# EAGLE schematic EsquematicoPractica1 (EAGLE 8.6.0)

## Sheet 1 of 2
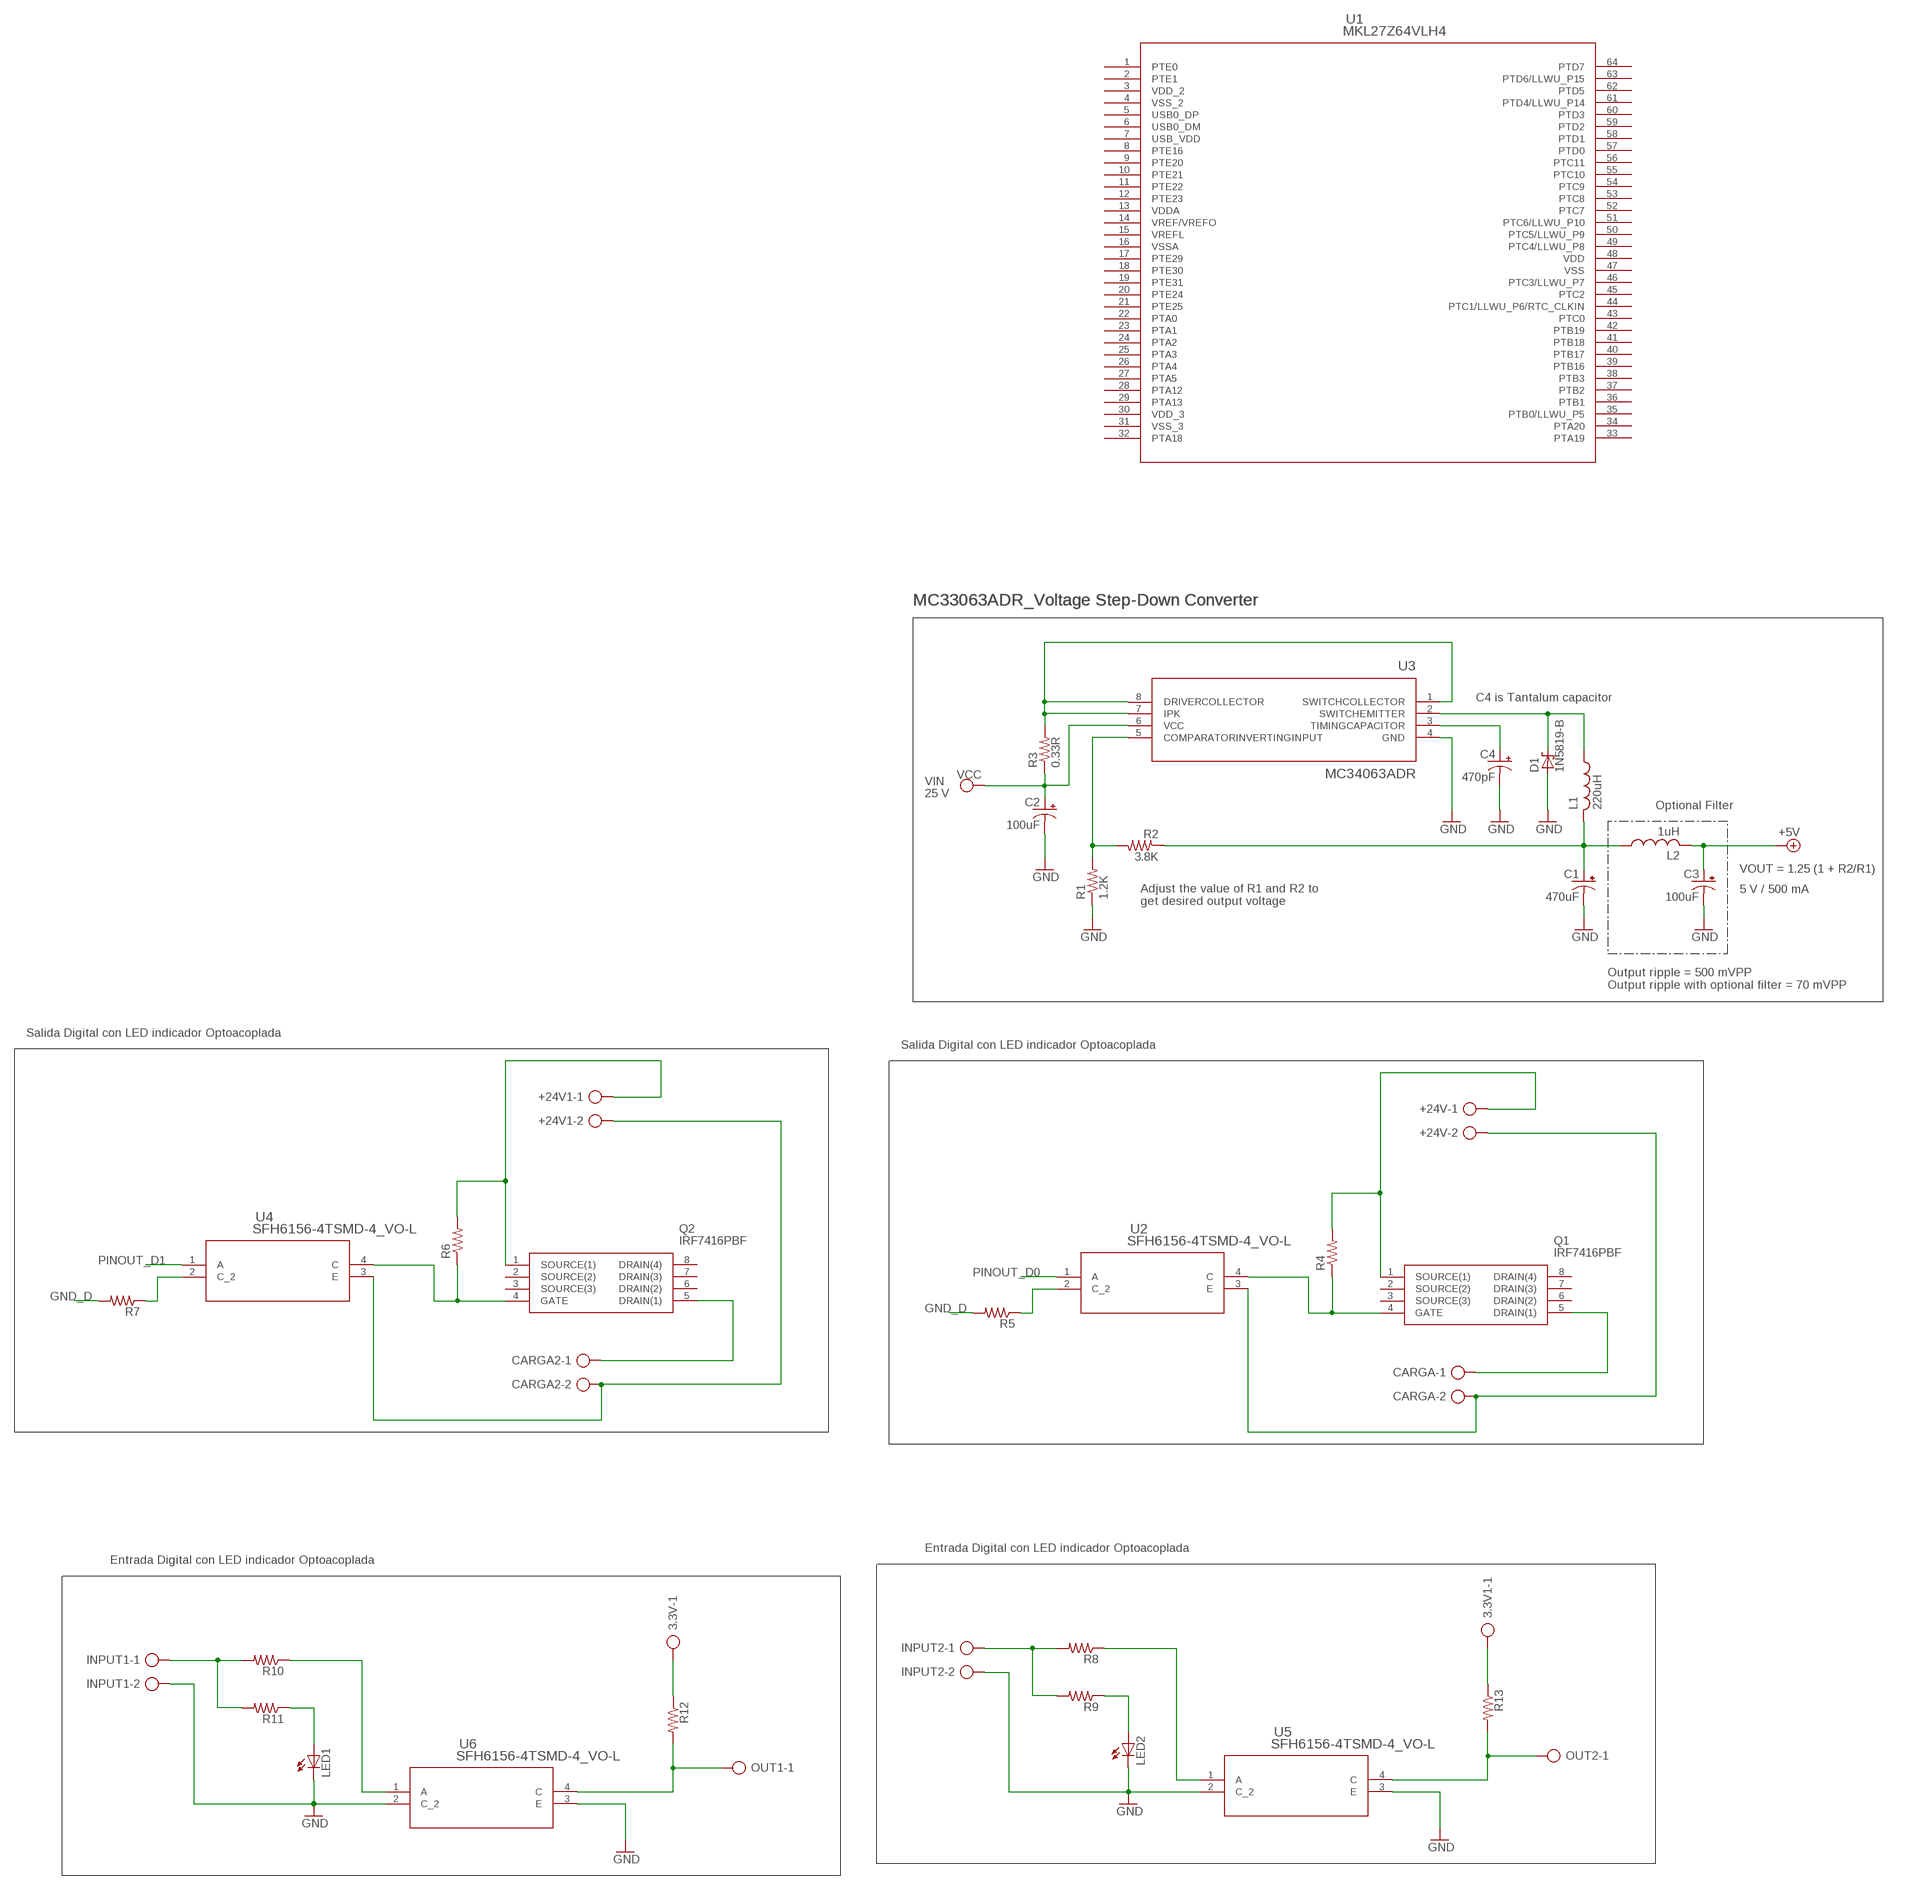
[diagram p0: schematic, sheet 1]

### Parts
3.3V  AK300/2  [AK300/2]
3.3V1  AK300/2  [AK300/2]
+24V  AK300/2  [AK300/2]
+24V1  AK300/2  [AK300/2]
C1  470uF  CPOL-USE7.5-16  [E7,5-16]
C2  100uF  CPOL-USE2,5-6E  [E2,5-6E]
C3  100uF  CPOL-USE2,5-6E  [E2,5-6E]
C4  470pF  CPOL-USE2,5-6E  [E2,5-6E]
CARGA  AK300/2  [AK300/2]
CARGA2  AK300/2  [AK300/2]
D1  1N5819-B  [DO41-7.6]
INPUT1  AK300/2  [AK300/2]
INPUT2  AK300/2  [AK300/2]
L1  220uH  L-USL3216C  [L3216C]
L2  1uH  L-USL3216C  [L3216C]
LED1  LED5MM  [LED5MM]
LED2  LED5MM  [LED5MM]
OUT1  AK300/2  [AK300/2]
OUT2  AK300/2  [AK300/2]
Q1  IRF7416PBF  [SOIC127P600X175-8N]
Q2  IRF7416PBF  [SOIC127P600X175-8N]
R1  1.2K  R-US_M0805  [M0805]
R2  3.8K  R-US_M0805  [M0805]
R3  0.33R  R-US_M0805  [M0805]
R4  R-US_0309/12  [0309/12]
R5  R-US_0309/12  [0309/12]
R6  R-US_0309/12  [0309/12]
R7  R-US_0309/12  [0309/12]
R8  R-US_0204/7  [0204/7]
R9  R-US_0204/7  [0204/7]
R10  R-US_0204/7  [0204/7]
R11  R-US_0204/7  [0204/7]
R12  R-US_0204/7  [0204/7]
R13  R-US_0204/7  [0204/7]
U1  MKL27Z64VLH4  [98ASS23234W]
U2  SFH6156-4TSMD-4_VO-L  [SMD-4_VO-L]
U3  MC34063ADR  [D8]
U4  SFH6156-4TSMD-4_VO-L  [SMD-4_VO-L]
U5  SFH6156-4TSMD-4_VO-L  [SMD-4_VO-L]
U6  SFH6156-4TSMD-4_VO-L  [SMD-4_VO-L]

### Nets
+5V: C3.+ L2.2
GND: C1.- C2.- C3.- C4.- D1.A R1.1 U3.4(GND) U5.3(E) U6.3(E) ; also sheet 2
GND_D: R5.2 R7.2
N$1: Q1.4(GATE) R4.1 U2.4(C)
N$2: D1.C L1.1 U3.2(SWITCHEMITTER)
N$3: C1.+ L1.2 L2.1 R2.1
N$4: C4.+ U3.3(TIMINGCAPACITOR)
N$5: R5.1 U2.2(C_2)
N$6: CARGA.1 Q1.5(DRAIN(1))
N$7: R1.2 R2.2 U3.5(COMPARATORINVERTINGINPUT)
N$8: +24V.1 Q1.1(SOURCE(1)) R4.2
N$9: R3.2 U3.1(SWITCHCOLLECTOR) U3.7(IPK) U3.8(DRIVERCOLLECTOR)
N$10: +24V.2 CARGA.2 U2.3(E)
N$11: Q2.4(GATE) R6.1 U4.4(C)
N$12: +24V1.1 Q2.1(SOURCE(1)) R6.2
N$13: R7.1 U4.2(C_2)
N$14: CARGA2.1 Q2.5(DRAIN(1))
N$15: +24V1.2 CARGA2.2 U4.3(E)
N$16: INPUT2.1 R8.2 R9.2
N$17: R8.1 U5.1(A)
N$18: LED2.A R9.1
N$19: OUT2.1 R13.2 U5.4(C)
N$20: 3.3V1.1 R13.1
N$21: INPUT1.1 R10.2 R11.2
N$22: R10.1 U6.1(A)
N$23: 3.3V.1 R12.1
N$24: LED1.A R11.1
N$25: INPUT1.2 INPUT2.2 LED1.K(C) LED2.K(C) U5.2(C_2) U6.2(C_2) ; supply symbol labelled GND
N$28: OUT1.1 R12.2 U6.4(C)
PINOUT_D0: U2.1(A)
PINOUT_D1: U4.1(A)
VCC: C2.+ R3.1 U3.6(VCC)
Unconnected: 3.3V1.2 3.3V.2 OUT1.2 OUT2.2 Q1.2(SOURCE(2)) Q1.3(SOURCE(3)) Q1.6(DRAIN(2)) Q1.7(DRAIN(3)) Q1.8(DRAIN(4)) Q2.2(SOURCE(2)) Q2.3(SOURCE(3)) Q2.6(DRAIN(2)) Q2.7(DRAIN(3)) Q2.8(DRAIN(4)) U1.1(PTE0) U1.2(PTE1) U1.5(USB0_DP) U1.6(USB0_DM) U1.8(PTE16) U1.9(PTE20) U1.10(PTE21) U1.11(PTE22) U1.12(PTE23) U1.17(PTE29) U1.18(PTE30) U1.19(PTE31) U1.20(PTE24) U1.21(PTE25) U1.22(PTA0) U1.23(PTA1) U1.24(PTA2) U1.25(PTA3) U1.26(PTA4) U1.27(PTA5) U1.28(PTA12) U1.29(PTA13) U1.32(PTA18) U1.33(PTA19) U1.34(PTA20) U1.35(PTB0/LLWU_P5) U1.36(PTB1) U1.37(PTB2) U1.38(PTB3) U1.39(PTB16) U1.40(PTB17) U1.41(PTB18) U1.42(PTB19) U1.43(PTC0) U1.44(PTC1/LLWU_P6/RTC_CLKIN) U1.45(PTC2) U1.46(PTC3/LLWU_P7) U1.49(PTC4/LLWU_P8) U1.50(PTC5/LLWU_P9) U1.51(PTC6/LLWU_P10) U1.52(PTC7) U1.53(PTC8) U1.54(PTC9) U1.55(PTC10) U1.56(PTC11) U1.57(PTD0) U1.58(PTD1) U1.59(PTD2) U1.60(PTD3) U1.61(PTD4/LLWU_P14) U1.62(PTD5) U1.63(PTD6/LLWU_P15) U1.64(PTD7)

### Notes on the sheet
- MC33063ADR_Voltage Step-Down Converter | MC33063ADR_Voltage Step-Down Converter
- C4 is Tantalum capacitor
- VIN
- 25 V
- Optional Filter
- VOUT = 1.25 (1 + R2/R1)
- 5 V / 500 mA
- Adjust the value of R1 and R2 to
  get desired output voltage
- Output ripple = 500 mVPP
  Output ripple with optional filter = 70 mVPP
- Salida Digital con LED indicador Optoacoplada
- Salida Digital con LED indicador Optoacoplada
- Entrada Digital con LED indicador Optoacoplada
- Entrada Digital con LED indicador Optoacoplada

## Sheet 2 of 2
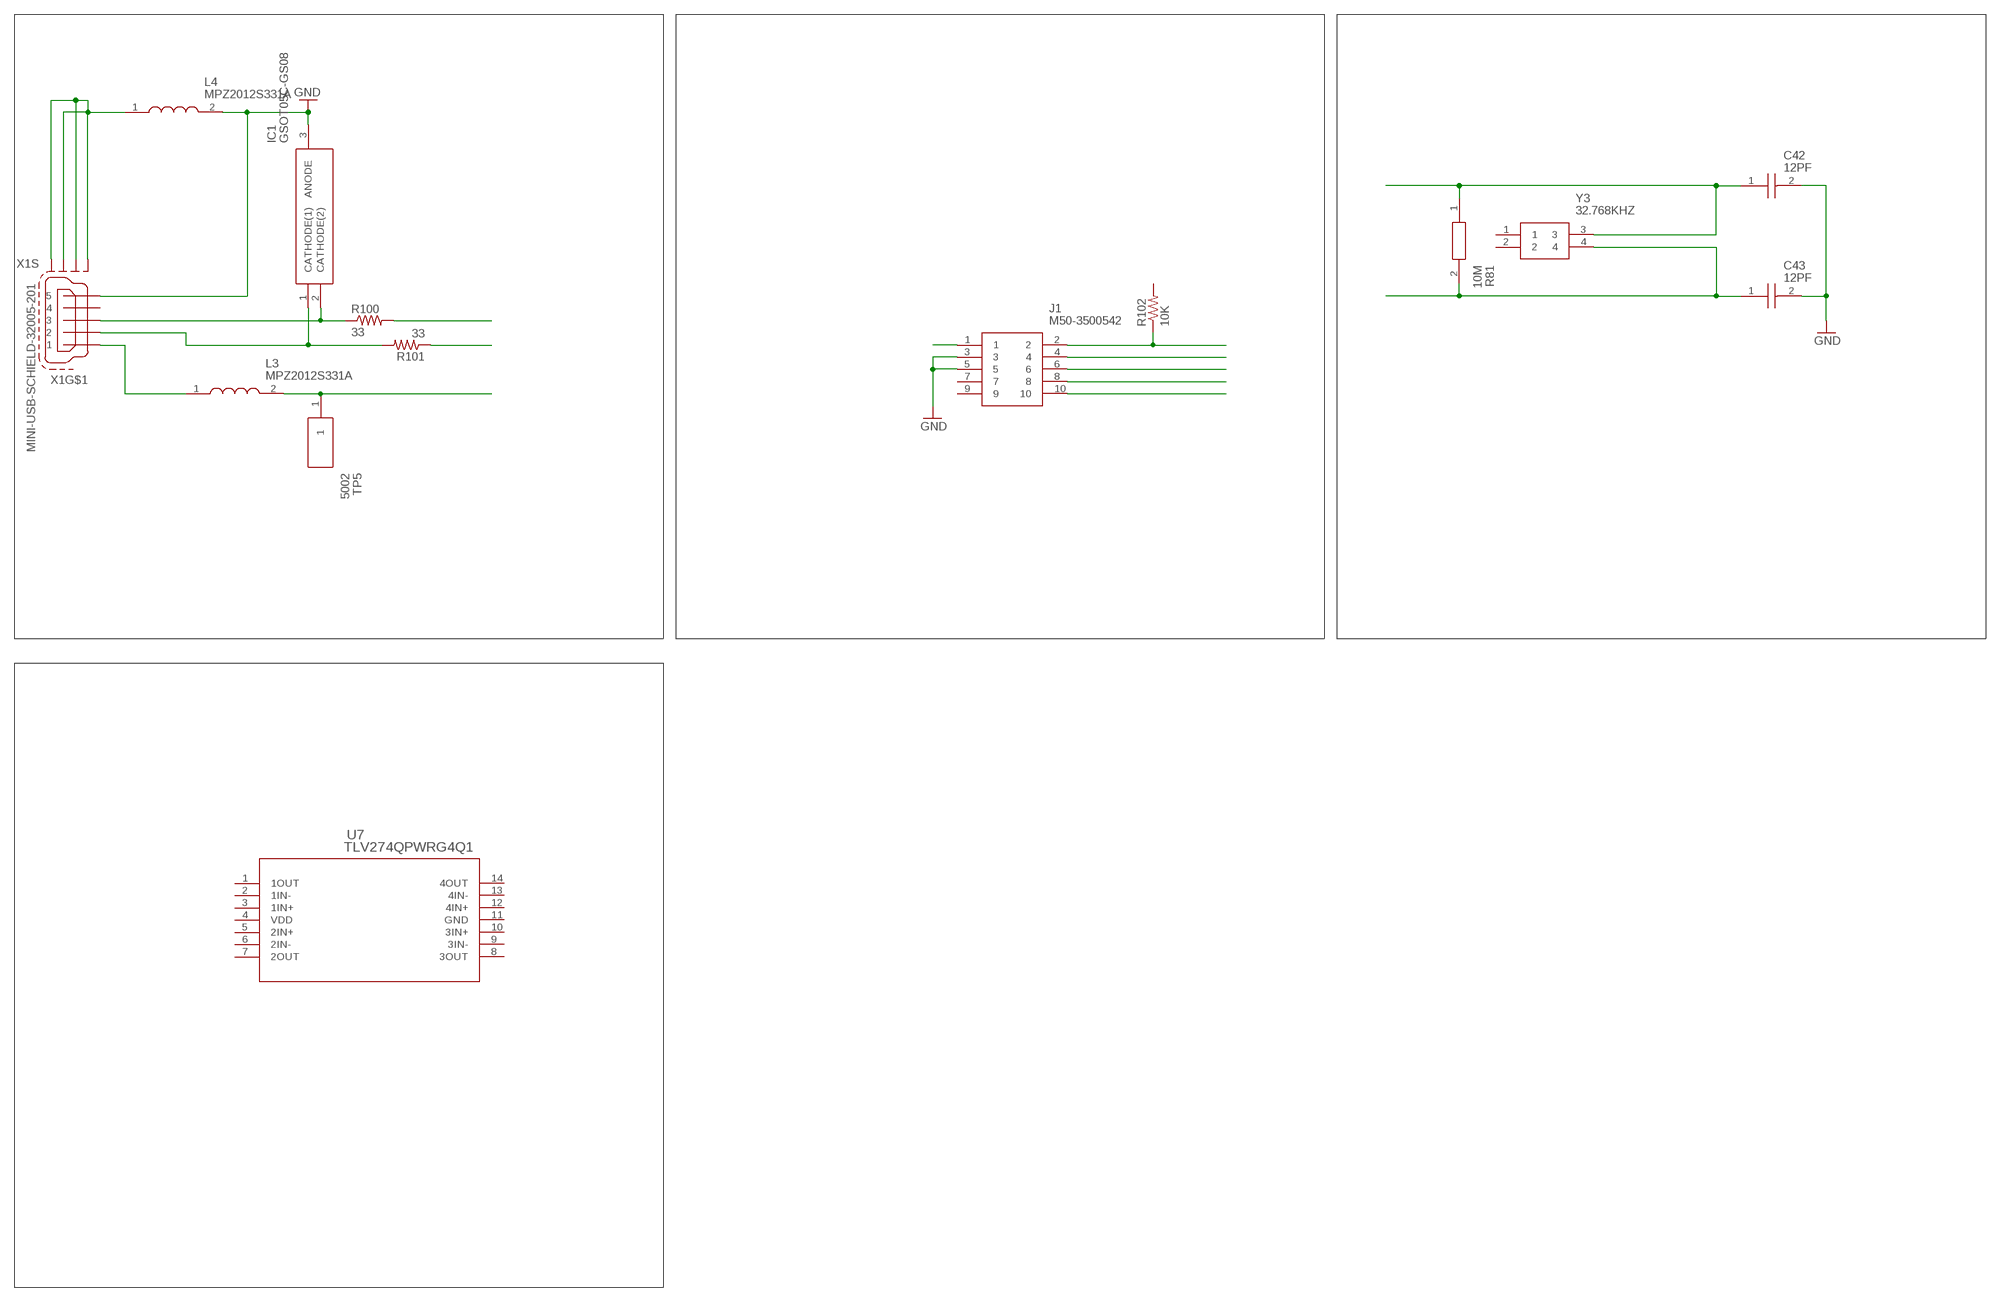
[diagram p1: schematic, sheet 2]

### Parts
C42  12PF  GRM1555C1H120JA01D  [CAPC1005X55N]
C43  12PF  GRM1555C1H120JA01D  [CAPC1005X55N]
IC1  GSOT05C-GS08  [SOT95P248X115-3N]
J1  M50-3500542  [HDRV10W40P127_2X5_635X345X415P]
L3  MPZ2012S331A  MPZ2012S331AT000  [INDC2012X105N]
L4  MPZ2012S331A  MPZ2012S331AT000  [INDC2012X105N]
R81  10M  RK73H1JLTD1005F  [RESC1608X55N]
R100  33  R-US_M1206  [M1206]
R101  33  R-US_M1206  [M1206]
R102  10K  R-US_M1206  [M1206]
TP5  5002  [5002]
U7  TLV274QPWRG4Q1  [PW14]
X1  MINI-USB-SCHIELD-32005-201  [32005-201]
Y3  32.768KHZ  ABS25-32.768KHZ-T  [ABS2532768KHZT]

### Nets
GND: C42.2 C43.2 IC1.3(ANODE) J1.3 J1.5 L4.2 X1.5 ; also sheet 1
N$26: L3.2 TP5.1
N$27: IC1.2(CATHODE(2)) R100.1 X1.3
N$29: IC1.1(CATHODE(1)) R101.2 X1.2
N$30: L3.1 X1.1
N$31: L4.1 X1.M1(S:S1) X1.M2(S:S2) X1.M3(S:S3) X1.M4(S:S4)
N$32: R100.2
N$33: R101.1
N$34: J1.2 R102.1
N$35: C42.1 R81.1 Y3.3
N$36: J1.4
N$37: J1.6
N$38: J1.8
N$39: J1.10
N$40: J1.1
N$41: C43.1 Y3.4
Unconnected: J1.7 J1.9 R81.2 R102.2 U7.1(1OUT) U7.2(1IN-) U7.3(1IN+) U7.5(2IN+) U7.6(2IN-) U7.7(2OUT) U7.8(3OUT) U7.9(3IN-) U7.10(3IN+) U7.12(4IN+) U7.13(4IN-) U7.14(4OUT) X1.4 Y3.1 Y3.2

## Power pins joined to a net without a drawn wire
GND: U7.11(GND)
USB_VDD: U1.7(USB_VDD)
VDD: U1.48(VDD) U7.4(VDD)
VDD_2: U1.3(VDD_2)
VDD_3: U1.30(VDD_3)
VDDA: U1.13(VDDA)
VREF/VREFO: U1.14(VREF/VREFO)
VREFL: U1.15(VREFL)
VSS: U1.47(VSS)
VSS_2: U1.4(VSS_2)
VSS_3: U1.31(VSS_3)
VSSA: U1.16(VSSA)

## Library data of the parts
3.3V 3.3V1 +24V +24V1 CARGA CARGA2 INPUT1 INPUT2 OUT1 OUT2 = con-ptr500:AK300/2: CONNECTOR; OC_FARNELL: unknown; OC_NEWARK: unknown
C1-C4 = rcl:CPOL-US: POLARIZED CAPACITOR, American symbol
C42 C43 = GRM1555C1H120JA01D:GRM1555C1H120JA01D: Ceramic SMT capacitor 12pF 50Vdc Murata 0402 GRM 12pF Ceramic Multilayer Capacitor, 50 V dc C0G Dielectric 5% Source: Datasheet <http://www.murata.com/~/media/webrenewal/support/library/catalog/products/capacitor/mlcc/c02e.pdf>; DESCRIPTION: Ceramic SMT capacitor 12pF 50Vdc Murata 0402 GRM 12pF Ceramic Multilayer Capacitor, 50 V dc C0G Dielectric 5%; HEIGHT: 0.55mm; MANUFACTURER_NAME: Murata Electronics; MANUFACTURER_PART_NUMBER: GRM1555C1H120JA01D; RS_PART_NUMBER: 7235367; RS_PRICE/STOCK: http://uk.rs-online.com/web/p/products/7235367
D1 = diode:1N581*: 1.0A SCHOTTKY BARRIER RECTIFIER Source: http://www.diodes.com/datasheets/ds23001.pdf
IC1 = GSOT05C-GS08:GSOT05C-GS08: VISHAY - GSOT05C-GS08 - TVS DIODE ARRAY, 504W, 5V, SOT-23, FULL REEL Source: Datasheet <https://www.vishay.com/docs/85824/gsot03c.pdf>; DESCRIPTION: VISHAY - GSOT05C-GS08 - TVS DIODE ARRAY, 504W, 5V, SOT-23, FULL REEL; HEIGHT: 1.15mm; MANUFACTURER_NAME: Vishay; MANUFACTURER_PART_NUMBER: GSOT05C-GS08
J1 = M50-3500542:M50-3500542: Header 2x5way DIL VERT Pin HARWIN M50-35 Series, 1.27mm Pitch 10 Way 2 Row Straight PCB Header, Solder Termination, 1A Source: Datasheet <http://docs-europe.electrocomponents.com/webdocs/13d4/0900766b813d4011.pdf>; DESCRIPTION: Header 2x5way DIL VERT Pin HARWIN M50-35 Series, 1.27mm Pitch 10 Way 2 Row Straight PCB Header, Solder Termination, 1A; HEIGHT: 4.15mm; MANUFACTURER_NAME: HARWIN; MANUFACTURER_PART_NUMBER: M50-3500542; RS_PART_NUMBER: 6811184P; RS_PRICE/STOCK: http://uk.rs-online.com/web/p/products/6811184P
L1 L2 = rcl:L-US: INDUCTOR, American symbol
L3 L4 = MPZ2012S331AT000:MPZ2012S331AT000: Ferrite Beads Multi-Layer Power 330Ohm 25% 100MHz 2.5A 50mOhm DCR 0805 T/R Source: Datasheet <https://product.tdk.com/info/en/catalog/datasheets/beads_commercial_power_mpz2012_en.pdf>; DESCRIPTION: Ferrite Beads Multi-Layer Power 330Ohm 25% 100MHz 2.5A 50mOhm DCR 0805 T/R; HEIGHT: 1.05mm; MANUFACTURER_NAME: TDK; MANUFACTURER_PART_NUMBER: MPZ2012S331AT000
LED1 LED2 = led:LED: LED OSRAM: - CHIPLED LG R971, LG N971, LY N971, LG Q971, LY Q971, LO R971, LY R971 LH N974, LH R974 LS Q976, LO Q976, LY Q976 LO Q996 - Hyper CHIPLED LW Q18S LB Q993, LB Q99A, LB R99A - SideLED LS A670, LO A670, LY A670, LG A670, LP A670 LB A673, LV A673, LT A673, LW A673 LH A674 LY A675 LS A676, LA A676, LO A676, LY A676, LW A676 LS A679, LY A679, LG A679 - Hyper Micro SIDELED® LS Y876, LA Y876, LO Y876, LY Y876 LT Y87S - SmartLED LW L88C, LW L88S LB L89C, LB L89S, LG L890 LS L89K, LO L89K, LY L89K LS L896, LA L896, LO L896, LY L896 - TOPLED LS T670, LO T670, LY T670, LG T670, LP T670 LSG T670, LSP T670, LSY T670, LOP T670, LYG T670 LG T671, LOG T671, LSG T671 LB T673, LV T673, LT T673, LW T673 LH T674 LS T676, LA T676, LO T676, LY T676, LB T676, LH T676, LSB T676, LW T676 LB T67C, LV T67C, LT T67C, LS T67K, LO T67K, LY T67K, LW E67C LS E67B, LA E67B, LO E67B, LY E67B, LB E67C, LV E67C, LT E67C LW T67C LS T679, LY T679, LG T679 LS T770, LO T770, LY T770, LG T770, LP T770 LB T773, LV T773, LT T773, LW T773 LH T774 LS E675, LA E675, LY E675, LS T675 LS T776, LA T776, LO T776, LY T776, LB T776 LHGB T686 LT T68C, LB T68C - Hyper Mini TOPLED® LB M676 - Mini TOPLED Santana® LG M470 LS M47K, LO M47K, LY M47K Source: http://www.osram.convergy.de LUXEON: - LUMILED® LXK2-PW12-R00, LXK2-PW12-S00, LXK2-PW14-U00, LXK2-PW14-V00 LXK2-PM12-R00, LXK2-PM12-S00, LXK2-PM14-U00 LXK2-PE12-Q00, LXK2-PE12-R00, LXK2-PE12-S00, LXK2-PE14-T00, LXK2-PE14-U00 LXK2-PB12-K00, LXK2-PB12-L00, LXK2-PB12-M00, LXK2-PB14-N00, LXK2-PB14-P00, LXK2-PB14-Q00 LXK2-PR12-L00, LXK2-PR12-M00, LXK2-PR14-Q00, LXK2-PR14-R00 LXK2-PD12-Q00, LXK2-PD12-R00, LXK2-PD12-S00 LXK2-PH12-R00, LXK2-PH12-S00 LXK2-PL12-P00, LXK2-PL12-Q00, LXK2-PL12-R00 Source: www.luxeon.com KINGBRIGHT: KA-3528ASYC Source: www.kingbright.com
Q1 Q2 = IRF7416PBF_Completo:IRF7416PBF: MOSFET P-Channel 30V 10A HEXFET SOIC8 Infineon IRF7416PBF P-channel MOSFET Transistor, 10 A, 30 V, 8-Pin SOIC Source: Datasheet <https://componentsearchengine.com/Datasheets/2/IRF7416PBF.pdf>; DESCRIPTION: MOSFET P-Channel 30V 10A HEXFET SOIC8 Infineon IRF7416PBF P-channel MOSFET Transistor, 10 A, 30 V, 8-Pin SOIC; HEIGHT: 1.75mm; MANUFACTURER_NAME: Infineon; MANUFACTURER_PART_NUMBER: IRF7416PBF; RS_PART_NUMBER: 5410143; SUPPLIER_NAME: RS
R1-R13 R100-R102 = rcl:R-US_: RESISTOR, American symbol; SPICEPREFIX: R
R81 = RK73H1JLTD1005F:RK73H1JLTD1005F: Thick Film Resistors - SMD 1/10watts 10Mohms 1% Source: Datasheet <http://www.koaspeer.com/catimages/Products/RK73-RT/RK73-RT.pdf>; DESCRIPTION: Thick Film Resistors - SMD 1/10watts 10Mohms 1%; HEIGHT: 0.55mm; MANUFACTURER_NAME: KOA Speer; MANUFACTURER_PART_NUMBER: RK73H1JLTD1005F
TP5 = 5002:5002: KEYSTONE - 5002 - TEST POINT CONNECTOR Source: Datasheet <http://www.keyelco.com/product-pdf.cfm?p=1311>; ALLIED_NUMBER: 70799413; ALLIED_PRICE/STOCK: http://www.alliedelec.com/keystone-electronics-5002/70799413/; DESCRIPTION: KEYSTONE - 5002 - TEST POINT CONNECTOR; HEIGHT: mm; MANUFACTURER_NAME: Keystone Electronics; MANUFACTURER_PART_NUMBER: 5002; RS_PART_NUMBER: 2508838443; RS_PRICE/STOCK: http://uk.rs-online.com/web/p/products/2508838443
U1 = KL27:MKL27Z64VLH4; MANUFACTURER_PART_NUMBER: mkl27z64vlh4; VENDOR: Freescale
U2 U4-U6 = SFH6156-4T:SFH6156-4T; MANUFACTURER_PART_NUMBER: SFH61564T; VENDOR: Vishay
U3 = MC34063ADR:MC34063ADR; MANUFACTURER_PART_NUMBER: MC34063ADR; VENDOR: Texas Instruments
U7 = TLV274QPWRG4Q1:TLV274QPWRG4Q1; MANUFACTURER_PART_NUMBER: TLV274QPWRG4Q1; VENDOR: Texas Instruments
X1 = con-cypressindustries:MINI-USB-SCHIELD-: MINI USB-B Conector Source: www.cypressindustries.com; OC_FARNELL: unknown; OC_NEWARK: unknown
Y3 = ABS25-32.768KHZ-T:ABS25-32.768KHZ-T: ABRACON - ABS25-32.768KHZ-T - CRYSTAL, 32.768K, 12.5PF CL 8X2.5 SMD Source: Datasheet <http://www.abracon.com/Resonators/abs25.pdf>; DESCRIPTION: ABRACON - ABS25-32.768KHZ-T - CRYSTAL, 32.768K, 12.5PF CL 8X2.5 SMD; HEIGHT: 2mm; MANUFACTURER_NAME: ABRACON; MANUFACTURER_PART_NUMBER: ABS25-32.768KHZ-T